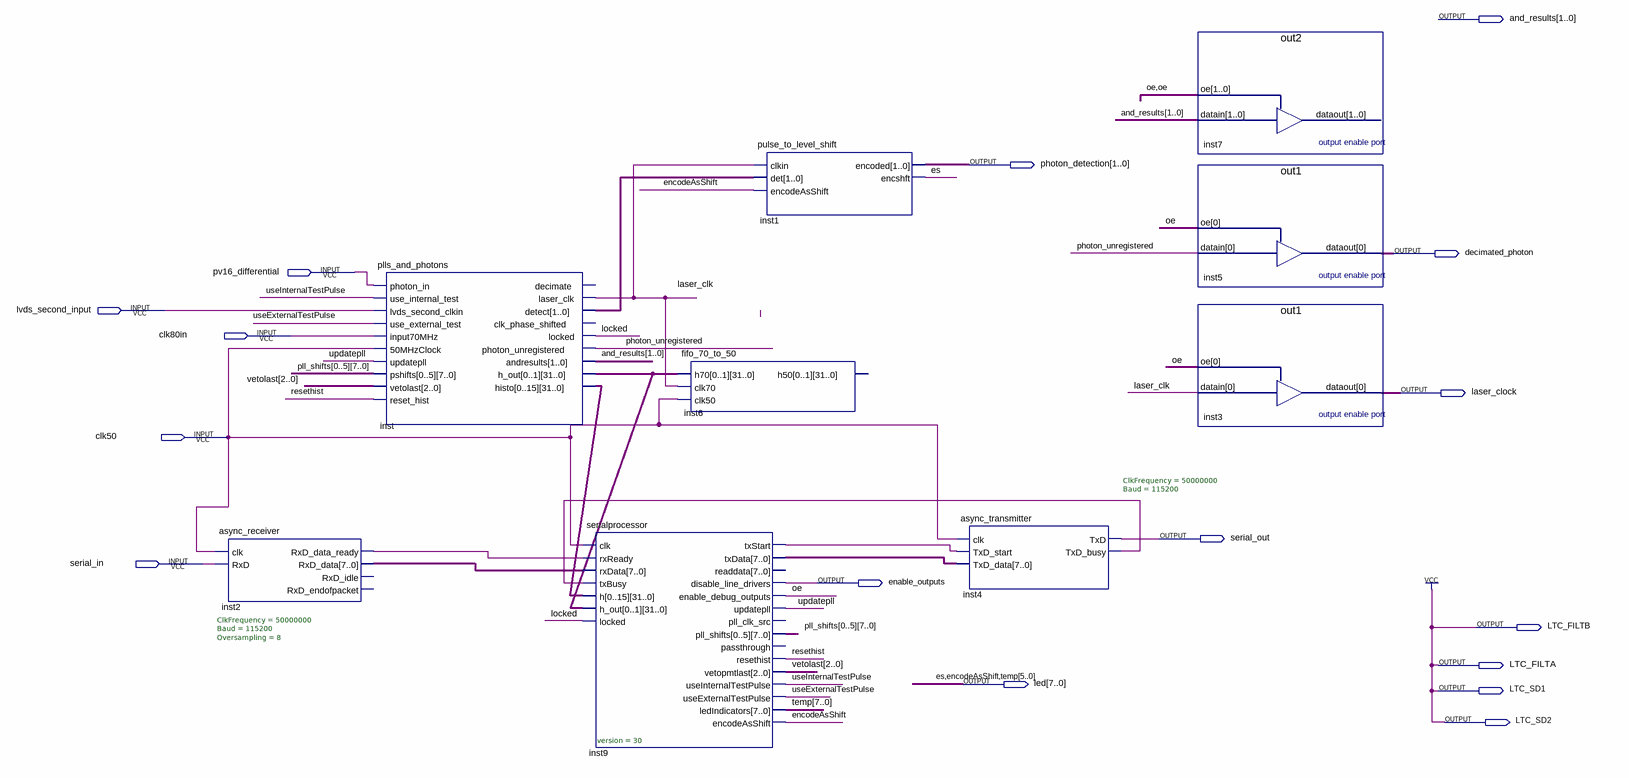
[diagram p0: schematic sheet]
// Quartus schematic coincidence.bdf as structural Verilog: 9 symbols, 16 pins
module coincidence (
  input  pv16_differential,
  input  lvds_second_input,
  input  clk80in,
  input  clk50,
  input  serial_in,
  output [1:0] and_results,
  output [1:0] photon_detection,
  output decimated_photon,
  output laser_clock,
  output serial_out,
  output enable_outputs,
  output LTC_FILTB,
  output LTC_FILTA,
  output [7:0] led,
  output LTC_SD1,
  output LTC_SD2
);

  wire inst2_rxd_data_ready, inst4_txd_busy, inst9_txstart, laser_clk, locked, oe, photon_unregistered,
       resethist, updatepll, useExternalTestPulse, useInternalTestPulse;
  wire [1:0] inst_detect;
  wire [2:0] vetolast;
  wire [7:0] inst2_rxd_data, inst9_txdata, pll_shifts_0, pll_shifts_1, pll_shifts_2, pll_shifts_3,
       pll_shifts_4, pll_shifts_5;
  wire [7:6] temp;
  wire [63:0] inst_h_out;
  wire [511:0] inst_histo;

  async_receiver #(.ClkFrequency(50000000), .Baud(115200), .Oversampling(8)) inst2 (
    .clk(clk50), .RxD(serial_in), .RxD_data_ready(inst2_rxd_data_ready), .RxD_data(inst2_rxd_data));  // open: RxD_idle, RxD_endofpacket
  plls_and_photons inst (
    .photon_in(pv16_differential), .use_internal_test(useInternalTestPulse),
    .lvds_second_clkin(lvds_second_input), .use_external_test(useExternalTestPulse), .input70MHz(clk80in),
    .\50MHzClock (clk50), .updatepll(updatepll),
    .pshifts({pll_shifts_0, pll_shifts_1, pll_shifts_2, pll_shifts_3, pll_shifts_4, pll_shifts_5}),
    .vetolast(vetolast), .reset_hist(resethist), .laser_clk(laser_clk), .detect(inst_detect),
    .locked(locked), .photon_unregistered(photon_unregistered), .andresults(and_results), .h_out(inst_h_out),
    .histo(inst_histo));  // open: decimate, clk_phase_shifted
  serialprocessor #(.version(30)) inst9 (
    .clk(clk50), .rxReady(inst2_rxd_data_ready), .rxData(inst2_rxd_data), .txBusy(inst4_txd_busy),
    .h(inst_histo), .h_out(inst_h_out), .locked(locked), .txStart(inst9_txstart), .txData(inst9_txdata),
    .disable_line_drivers(enable_outputs), .enable_debug_outputs(oe), .updatepll(updatepll),
    .pll_shifts({pll_shifts_0, pll_shifts_1, pll_shifts_2, pll_shifts_3, pll_shifts_4, pll_shifts_5}),
    .resethist(resethist), .vetopmtlast(vetolast), .useInternalTestPulse(useInternalTestPulse),
    .useExternalTestPulse(useExternalTestPulse), .ledIndicators({temp, led[5:0]}), .encodeAsShift(led[6]));  // open: readdata, pll_clk_src, passthrough
  fifo_70_to_50 inst6 (.h70(inst_h_out), .clk70(laser_clk), .clk50(clk50));  // open: h50
  pulse_to_level_shift inst1 (
    .clkin(laser_clk), .det(inst_detect), .encodeAsShift(led[6]), .encoded(photon_detection), .encshft(led[7]));
  async_transmitter #(.ClkFrequency(50000000), .Baud(115200)) inst4 (
    .clk(clk50), .TxD_start(inst9_txstart), .TxD_data(inst9_txdata), .TxD(serial_out),
    .TxD_busy(inst4_txd_busy));
  out2 inst7 (.datain(and_results), .oe({2{oe}}));  // open: dataout
  out1 inst5 (.datain(photon_unregistered), .oe(oe), .dataout(decimated_photon));
  out1 inst3 (.datain(laser_clk), .oe(oe), .dataout(laser_clock));

  assign LTC_FILTA = 1'b1;
  assign LTC_FILTB = 1'b1;
  assign LTC_SD1 = 1'b1;
  assign LTC_SD2 = 1'b1;

  // Other names for the same wires on the sheet: encodeAsShift = led[6]; es = led[7]; temp[5:0] = led[5:0]
endmodule
